# Altium schematic sheet HDMI1.SchDoc
size A3; SheetNumber: 7; SheetTotal: 11
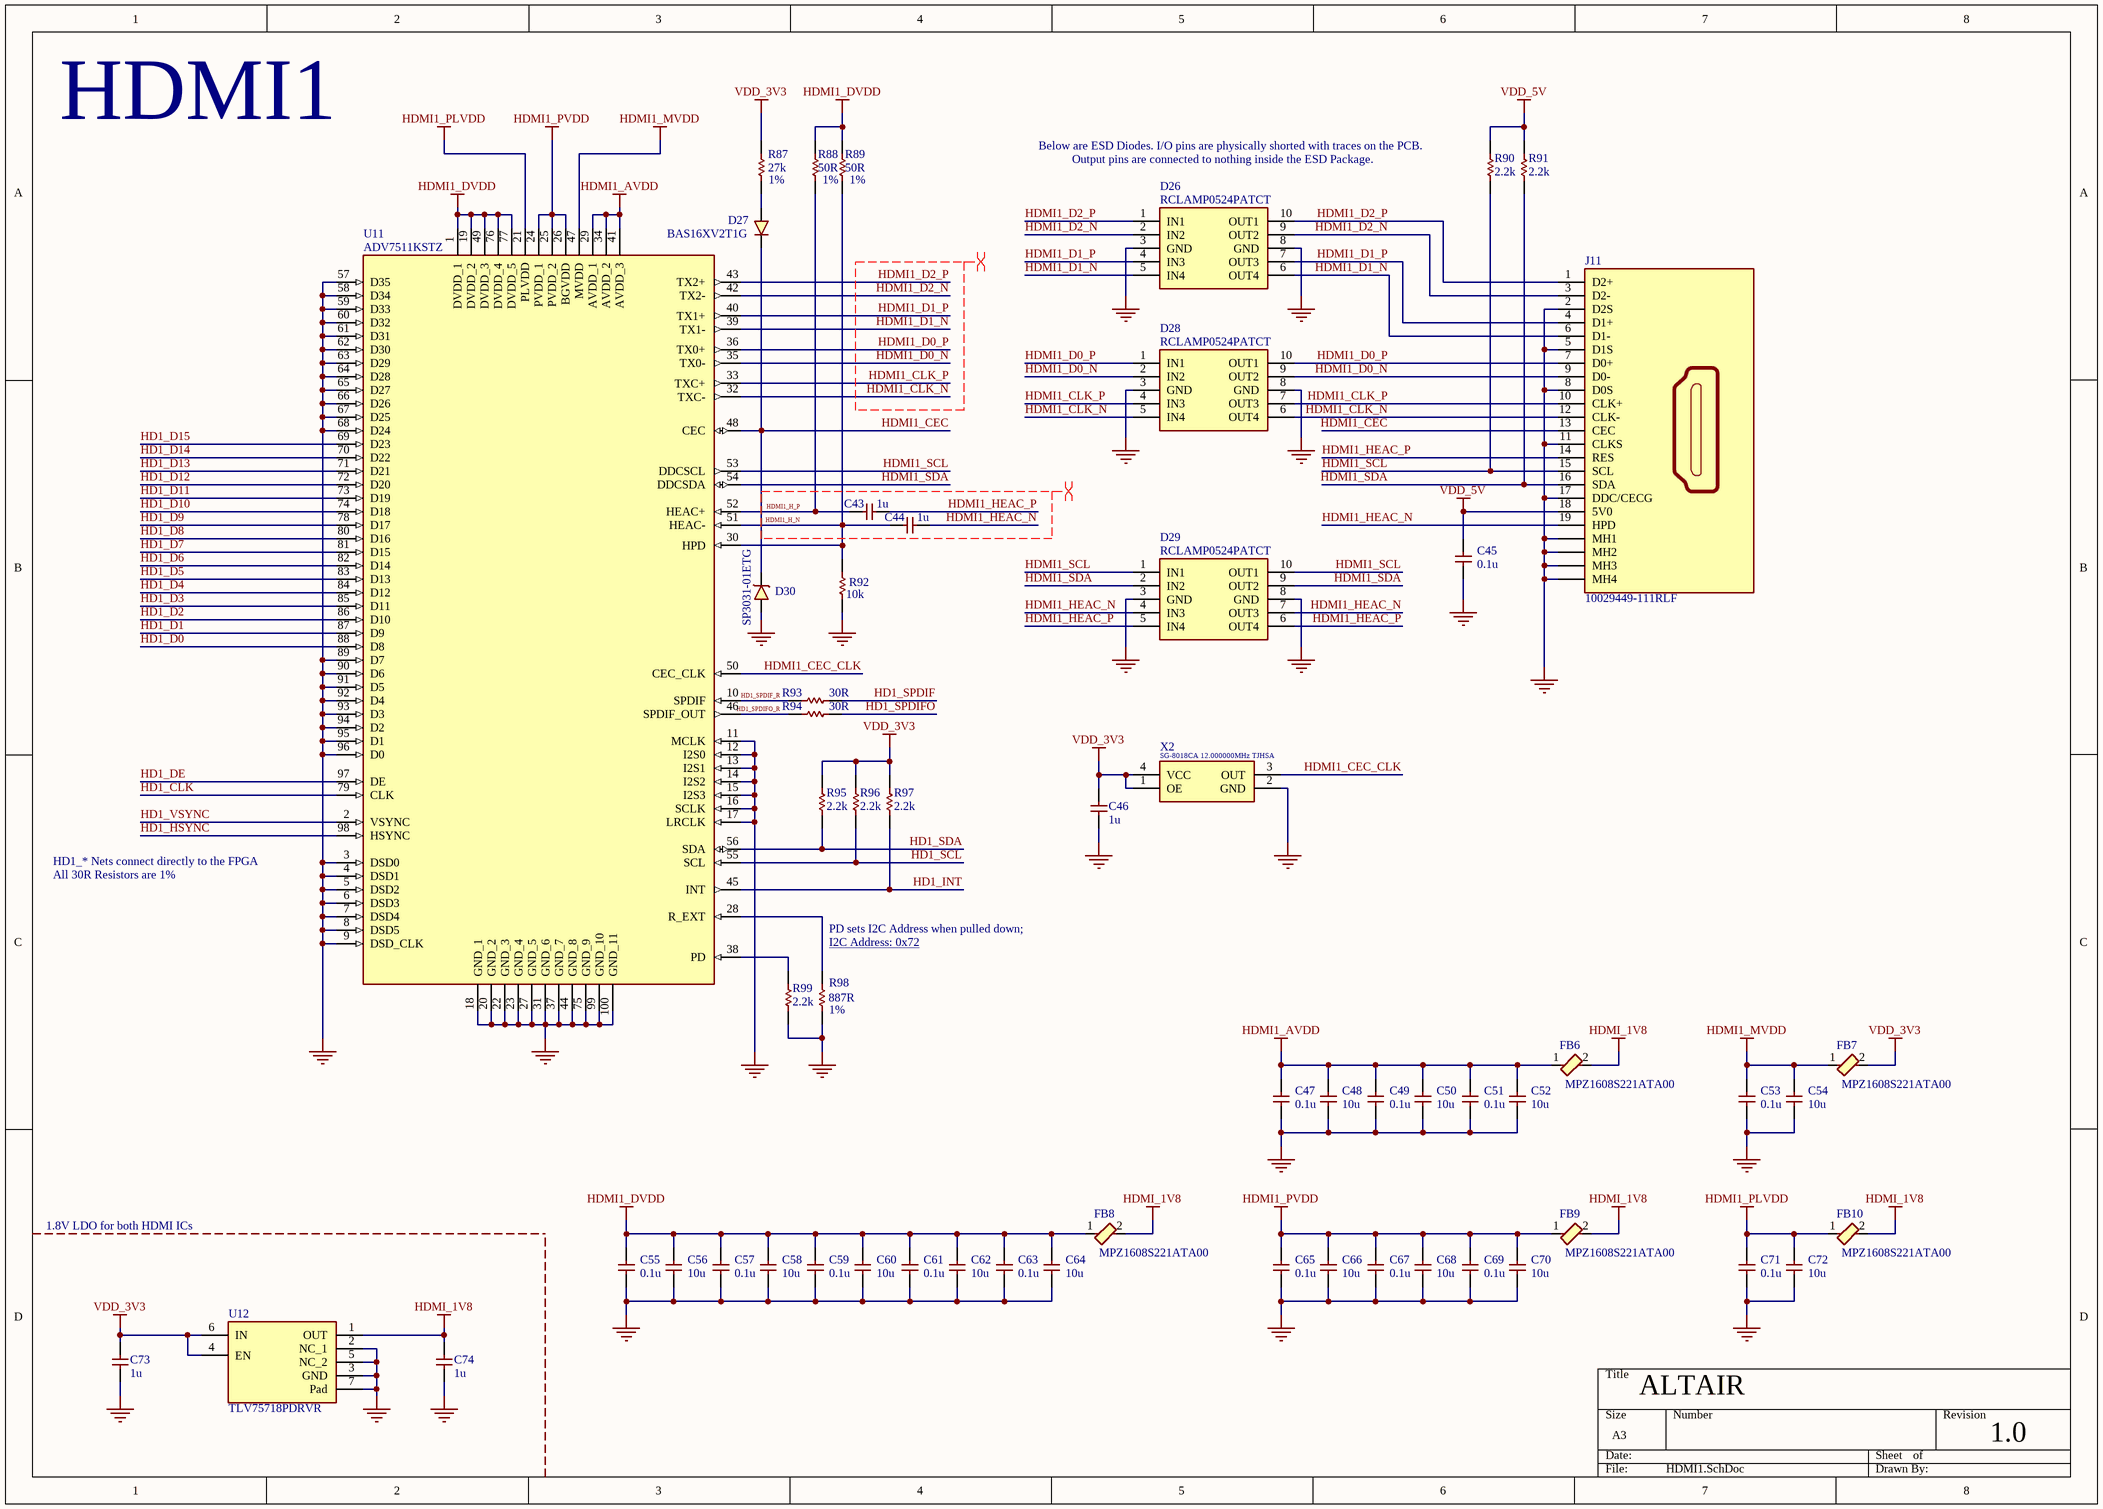
[diagram p0: HDMI1.SchDoc]

## Parts
C43  1u  [CAP_0402]
C44  1u  [CAP_0402]
C45  0.1u  [CAP_0402]
C46  1u  [CAP_0402]
C47  0.1u  [CAP_0402]
C48  10u  [CAP_0402]
C49  0.1u  [CAP_0402]
C50  10u  [CAP_0402]
C51  0.1u  [CAP_0402]
C52  10u  [CAP_0402]
C53  0.1u  [CAP_0402]
C54  10u  [CAP_0402]
C55  0.1u  [CAP_0402]
C56  10u  [CAP_0402]
C57  0.1u  [CAP_0402]
C58  10u  [CAP_0402]
C59  0.1u  [CAP_0402]
C60  10u  [CAP_0402]
C61  0.1u  [CAP_0402]
C62  10u  [CAP_0402]
C63  0.1u  [CAP_0402]
C64  10u  [CAP_0402]
C65  0.1u  [CAP_0402]
C66  10u  [CAP_0402]
C67  0.1u  [CAP_0402]
C68  10u  [CAP_0402]
C69  0.1u  [CAP_0402]
C70  10u  [CAP_0402]
C71  0.1u  [CAP_0402]
C72  10u  [CAP_0402]
C73  1u  [CAP_0402]
C74  1u  [CAP_0402]
D26  RCLAMP0524PATCT  [RCLAMP0524PATCT]
D27  BAS16XV2T1G  [SODFL1608X70N]
D28  RCLAMP0524PATCT  [RCLAMP0524PATCT]
D29  RCLAMP0524PATCT  [RCLAMP0524PATCT]
D30  SP3031-01ETG  [SP303101ETG]
FB6  220  [BEADC1608X75N]  (value not drawn)
FB7  220  [BEADC1608X75N]  (value not drawn)
FB8  220  [BEADC1608X75N]  (value not drawn)
FB9  220  [BEADC1608X75N]  (value not drawn)
FB10  220  [BEADC1608X75N]  (value not drawn)
J11  10029449-111RLF  [10029449111RLF]
R87  27k  Note/Misc: 1%  [RES_0402]
R88  50R  Note/Misc: 1%  [RES_0402]
R89  50R  Note/Misc: 1%  [RES_0402]
R90  2.2k  [RES_0402]
R91  2.2k  [RES_0402]
R92  10k  [RES_0402]
R93  30R  [RES_0402]
R94  30R  [RES_0402]
R95  2.2k  [RES_0402]
R96  2.2k  [RES_0402]
R97  2.2k  [RES_0402]
R98  887R  Note/Misc: 1%  [RES_0402]
R99  2.2k  [RES_0402]
U11  ADV7511KSTZ  [QFP50P1600X1600X160-100N]
U12  TLV75718PDRVR  [SON65P200X200X80-7N]
X2  SG-8018CA 12.000000MHz TJHSA  [SG8018CA147456MTJHPA3]  (value not drawn)

## Nets
GND: C45.1 C46.2 C47.1 C48.2 C49.1 C50.2 C51.1 C52.2 C53.1 C54.2 C55.1 C56.2 C57.1 C58.2 C59.1 C60.2 C61.1 C62.2 C63.1 C64.2 C65.1 C66.2 C67.1 C68.2 C69.1 C70.2 C71.1 C72.2 C73.2 C74.2 D26.3(GND) D26.8(GND) D28.3(GND) D28.8(GND) D29.3(GND) D29.8(GND) D30.2(A) J11.2(D2S) J11.5(D1S) J11.8(D0S) J11.11(CLKS) J11.17(DDC/CECG) J11.MH1 J11.MH2 J11.MH3 J11.MH4 R92.2 R98.2 R99.1 U11.3(DSD0) U11.4(DSD1) U11.5(DSD2) U11.6(DSD3) U11.7(DSD4) U11.8(DSD5) U11.9(DSD_CLK) U11.11(MCLK) U11.12(I2S0) U11.13(I2S1) U11.14(I2S2) U11.15(I2S3) U11.16(SCLK) U11.17(LRCLK) U11.18(GND_1) U11.20(GND_2) U11.22(GND_3) U11.23(GND_4) U11.27(GND_5) U11.31(GND_6) U11.37(GND_7) U11.44(GND_8) U11.57(D35) U11.58(D34) U11.59(D33) U11.60(D32) U11.61(D31) U11.62(D30) U11.63(D29) U11.64(D28) U11.65(D27) U11.66(D26) U11.67(D25) U11.68(D24) U11.75(GND_9) U11.89(D7) U11.90(D6) U11.91(D5) U11.92(D4) U11.93(D3) U11.94(D2) U11.95(D1) U11.96(D0) U11.99(GND_10) U11.100(GND_11) U12.2(NC_1) U12.3(GND) U12.5(NC_2) U12.7(Pad) X2.2(GND)
HDMI1_AVDD: C47.2 C48.1 C49.2 C50.1 C51.2 C52.1 FB6.1 U11.29(AVDD_1) U11.34(AVDD_2) U11.41(AVDD_3)
HDMI1_DVDD: C55.2 C56.1 C57.2 C58.1 C59.2 C60.1 C61.2 C62.1 C63.2 C64.1 FB8.1 R88.1 R89.1 U11.1(DVDD_1) U11.19(DVDD_2) U11.49(DVDD_3) U11.76(DVDD_4) U11.77(DVDD_5)
HDMI1_MVDD: C53.2 C54.1 FB7.1 U11.47(MVDD)
HDMI1_PLVDD: C71.2 C72.1 FB10.1 U11.21(PLVDD)
HDMI1_PVDD: C65.2 C66.1 C67.2 C68.1 C69.2 C70.1 FB9.1 U11.24(PVDD_1) U11.25(PVDD_2) U11.26(BGVDD)
HDMI_1V8: C74.1 FB6.2 FB8.2 FB9.2 FB10.2 U12.1(OUT)
VDD_3V3: C46.1 C73.1 FB7.2 R87.1 R95.2 R96.2 R97.2 U12.4(EN) U12.6(IN) X2.1(OE) X2.4(VCC)
VDD_5V: C45.2 J11.18(5V0) R90.2 R91.2
HD1_CLK: U11.79(CLK)
HD1_D0: U11.88(D8)
HD1_D1: U11.87(D9)
HD1_D2: U11.86(D10)
HD1_D3: U11.85(D11)
HD1_D4: U11.84(D12)
HD1_D5: U11.83(D13)
HD1_D6: U11.82(D14)
HD1_D7: U11.81(D15)
HD1_D8: U11.80(D16)
HD1_D9: U11.78(D17)
HD1_D10: U11.74(D18)
HD1_D11: U11.73(D19)
HD1_D12: U11.72(D20)
HD1_D13: U11.71(D21)
HD1_D14: U11.70(D22)
HD1_D15: U11.69(D23)
HD1_DE: U11.97(DE)
HD1_HSYNC: U11.98(HSYNC)
HD1_INT: R97.1 U11.45(INT)
HD1_SCL: R96.1 U11.55(SCL)
HD1_SDA: R95.1 U11.56(SDA)
HD1_SPDIF: R93.2
HD1_SPDIF_R: R93.1 U11.10(SPDIF)
HD1_SPDIFO: R94.2
HD1_SPDIFO_R: R94.1 U11.46(SPDIF_OUT)
HD1_VSYNC: U11.2(VSYNC)
HDMI1_CEC: D27.1(K) D30.1(K) J11.13(CEC) U11.48(CEC)
HDMI1_CEC_CLK: U11.50(CEC_CLK) X2.3(OUT)
HDMI1_CLK_N: D28.5(IN4) D28.6(OUT4) J11.12(CLK-) U11.32(TXC-)
HDMI1_CLK_P: D28.4(IN3) D28.7(OUT3) J11.10(CLK+) U11.33(TXC+)
HDMI1_D0_N: D28.2(IN2) D28.9(OUT2) J11.9(D0-) U11.35(TX0-)
HDMI1_D0_P: D28.1(IN1) D28.10(OUT1) J11.7(D0+) U11.36(TX0+)
HDMI1_D1_N: D26.5(IN4) D26.6(OUT4) J11.6(D1-) U11.39(TX1-)
HDMI1_D1_P: D26.4(IN3) D26.7(OUT3) J11.4(D1+) U11.40(TX1+)
HDMI1_D2_N: D26.2(IN2) D26.9(OUT2) J11.3(D2-) U11.42(TX2-)
HDMI1_D2_P: D26.1(IN1) D26.10(OUT1) J11.1(D2+) U11.43(TX2+)
HDMI1_H_N: C44.2 R89.2 R92.1 U11.30(HPD) U11.51(HEAC-)
HDMI1_H_P: C43.2 R88.2 U11.52(HEAC+)
HDMI1_HEAC_N: C44.1 D29.4(IN3) D29.7(OUT3) J11.19(HPD)
HDMI1_HEAC_P: C43.1 D29.5(IN4) D29.6(OUT4) J11.14(RES)
HDMI1_SCL: D29.1(IN1) D29.10(OUT1) J11.15(SCL) R90.1 U11.53(DDCSCL)
HDMI1_SDA: D29.2(IN2) D29.9(OUT2) J11.16(SDA) R91.1 U11.54(DDCSDA)
NetD27_2: D27.2(A) R87.2
NetR98_1: R98.1 U11.28(R_EXT)
NetR99_2: R99.2 U11.38(PD)

## Layout directives
differential pair: HDMI1_CLK_N, HDMI1_CLK_P, HDMI1_D0_N, HDMI1_D0_P, HDMI1_D1_N, HDMI1_D1_P, HDMI1_D2_N, HDMI1_D2_P, HDMI1_H_N, HDMI1_H_P, HDMI1_HEAC_N, HDMI1_HEAC_P

## Notes on the sheet
- HDMI1
- (near R90) Below are ESD Diodes. I/O pins are physically shorted with traces on the PCB.
- Output pins are connected to nothing inside the ESD Package.
- (near X2) SG-8018CA 12.000000MHz TJHSA
- HD1_* Nets connect directly to the FPGA
- All 30R Resistors are 1%
- PD sets I2C Address when pulled down;
- I2C Address: 0x72
- 1.8V LDO for both HDMI ICs
- ALTAIR
- 1.0

## Library data of the parts
C43 C44 C46 C73 C74 = CAP_0402: Capacitor SMD 0402; Part No: CL05A105KP5NNNC; Note/Misc: 10V; LCSC: *; JLCPCB Part #: C14445; Footprint JLCPCB: 0402
C45 C47 C49 C51 C53 C55 C57 C59 C61 C63 C65 C67 C69 C71 = CAP_0402: Capacitor SMD 0402; Part No: CL05B104KO5NNNC; Note/Misc: 16V, 0402; LCSC: *; JLCPCB Part #: C338112; Footprint JLCPCB: 0402
C48 C50 C52 C54 C56 C58 C60 C62 C64 C66 C68 C70 C72 = CAP_0402: Capacitor SMD 0402; Part No: CL05A106MP5NUNC; LCSC: *; JLCPCB Part #: C315248; Footprint JLCPCB: 0402
D26 D28 D29 = RCLAMP0524PATCT: TVS Diode (Uni-directional); LCSC: *; Note/Misc: *; Part No: RCLAMP0524PATCT; JLCPCB Part #: C40960; Footprint JLCPCB: DFN-10(1x2.5)
D27 = BAS16XV2T1G: Diode (Switching); LCSC: *; Note/Misc: *; Part No: BAS16XV2T1G; JLCPCB Part #: C152479; Footprint JLCPCB: SOD-523
D30 = SP3031-01ETG: TVS Diode (Uni-directional); Footprint JLCPCB: SOD-882; JLCPCB Part #: C207283; LCSC: *; Note/Misc: *; Part No: SP3031-01ETG
FB6-FB10 = MPZ1608S221ATA00: Ferrite Bead; LCSC: *; Note/Misc: *; Part No: MPZ1608S221ATA00; JLCPCB Part #: C76815; Footprint JLCPCB: 0603
J11 = 10029449-111RLF: HDMI Connector; LCSC: *; Note/Misc: *; Part No: 10029449-111RLF; JLCPCB Part #: C427307; Footprint JLCPCB: SMD
R87 = RES_0402: Resistor SMD 0402; Part No: RC0402FR-0727KL; LCSC: *; JLCPCB Part #: C138022; Footprint JLCPCB: 0402
R88 R89 = RES_0402: Resistor SMD 0402; Part No: RT0402BRE0750RL; LCSC: *; JLCPCB Part #: C853312; Footprint JLCPCB: 0402
R90 R91 R95-R97 R99 = RES_0402: Resistor SMD 0402; Part No: RC0402JR-072K2L; LCSC: *; JLCPCB Part #: C163447; Footprint JLCPCB: 0402
R92 = RES_0402: Resistor SMD 0402; Part No: RC0402JR-0710KL; LCSC: *; JLCPCB Part #: C60489; Footprint JLCPCB: 0402
R93 R94 = RES_0402: Resistor SMD 0402; Part No: RC0402FR-0730RL; Note/Misc: 1%; LCSC: *; JLCPCB Part #: C138007; Footprint JLCPCB: 0402
R98 = RES_0402: Resistor SMD 0402; Part No: CRCW0402887RFKED; LCSC: *; JLCPCB Part #: C4012675; Footprint JLCPCB: 0402
U11 = ADV7511KSTZ: HDMI RX IC; LCSC: *; Note/Misc: *; Part No: ADV7511KSTZ; JLCPCB Part #: C179459; Footprint JLCPCB: LQFP-100(14x14)
U12 = TLV75718PDRVR: LDO 1V8, 1V45-5V5 Input; LCSC: *; Note/Misc: *; Part No: TLV75718PDRVR; JLCPCB Part #: C2861386; Footprint JLCPCB: WSON-6-EP(2x2)
X2 = SG-8018CA 12.000000MHz TJHSA: 12 MHz Programmable Oscillator; LCSC: *; Note/Misc: *; JLCPCB Part #: C390417; Footprint JLCPCB: SMD7050-4P; Part No: SG-8018CA 12.000000MHz TJHSA